# Altium schematic sheet Robotic armmodified 3pin.SchDoc
size 305 x 143 mm
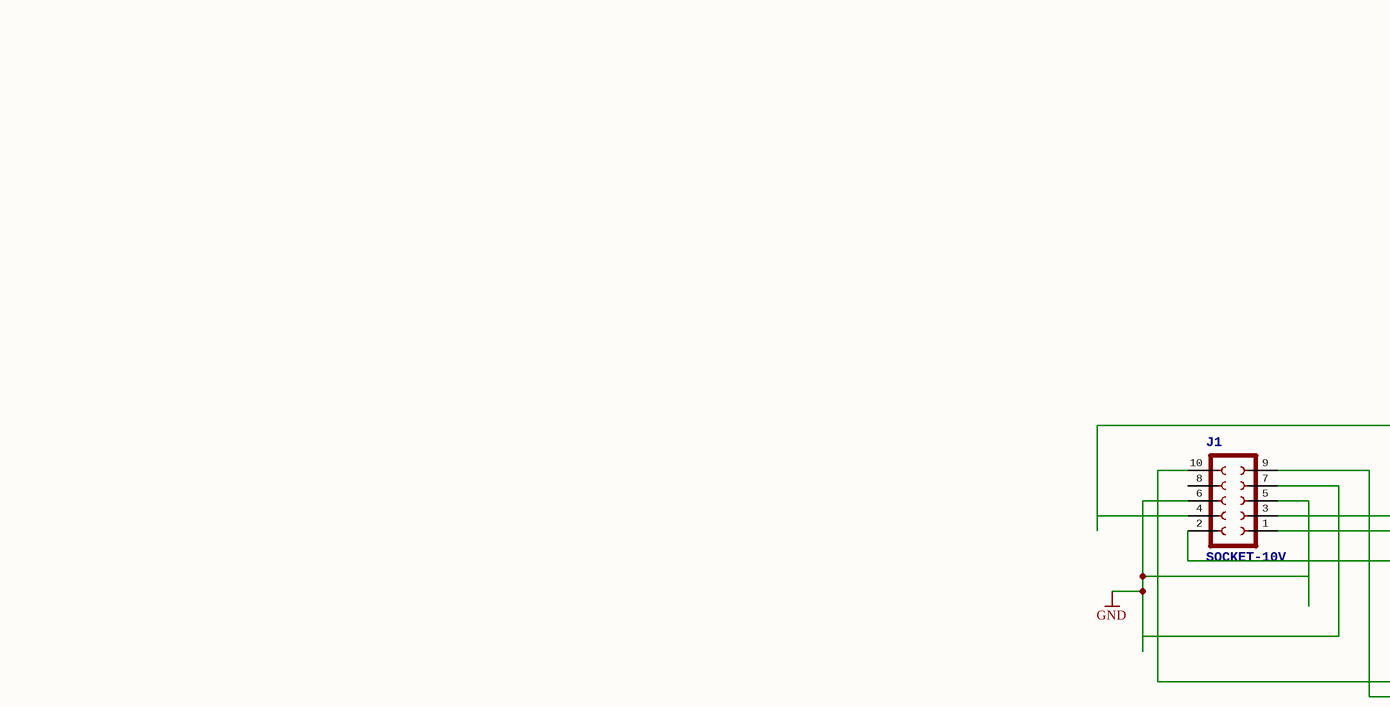
[diagram p0: Robotic armmodified 3pin.SchDoc, left]
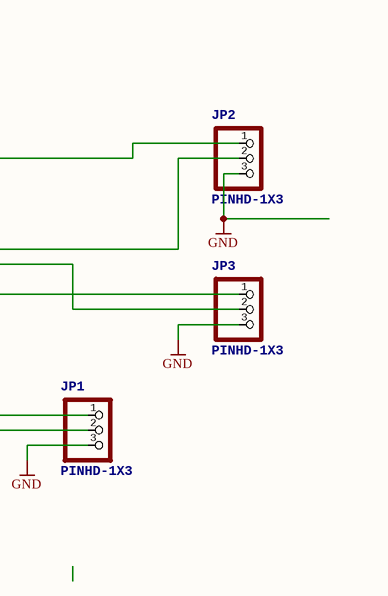
[diagram p1: Robotic armmodified 3pin.SchDoc, middle]

## Parts
J1  SOCKET-10V  [S10V]
JP1  PINHD-1X3  [1X03]
JP2  PINHD-1X3  [1X03]
JP3  PINHD-1X3  [1X03]
MRM1  MRMLogo: MRM Logo  [LOL]  (hidden comment: MRM)

## Nets
GND: J1.5 J1.6 J1.7 JP1.3 JP2.3 JP3.3
NetJ1_1: J1.1 JP3.2
NetJ1_2: J1.2 JP3.1
NetJ1_3: J1.3 JP2.2
NetJ1_4: J1.4 JP2.1
NetJ1_9: J1.9 JP1.2
NetJ1_10: J1.10 JP1.1

Not connected (* = marked no-connect by the designer): J1 8

## Library data of the parts
J1 = SOCKET-10V: 10 pin PCB Socket (3m 85xx/51xx)
JP1-JP3 = PINHD-1X3: PIN HEADER